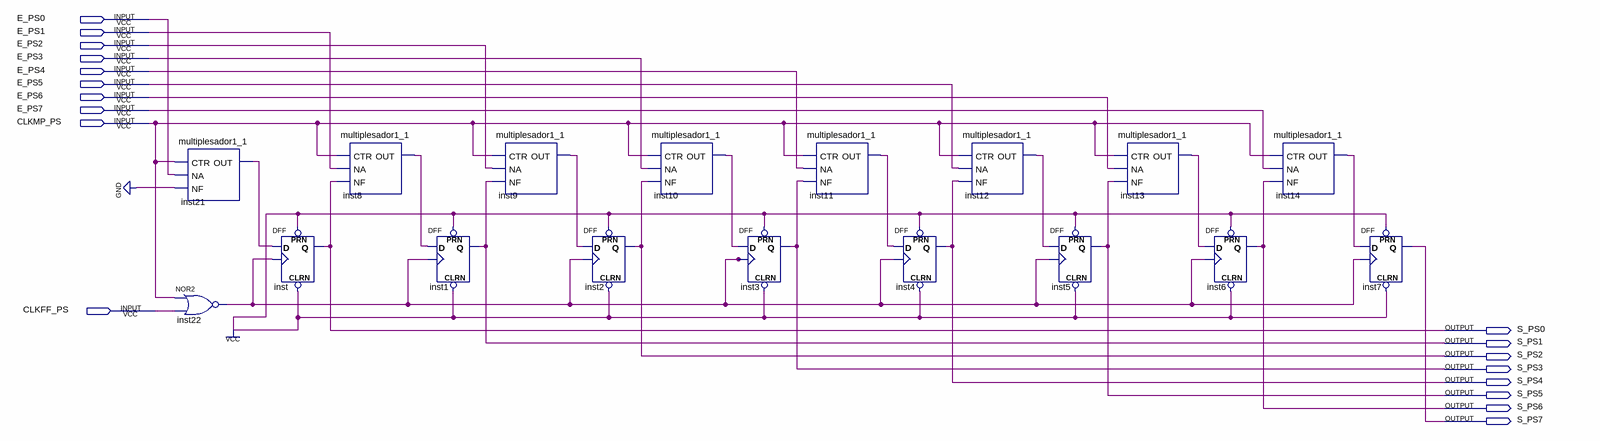
[diagram p0: schematic sheet]
// Quartus schematic PISO.bdf as structural Verilog: 17 symbols, 18 pins
module PISO (
  input  E_PS0,
  input  E_PS1,
  input  E_PS2,
  input  E_PS3,
  input  E_PS4,
  input  E_PS5,
  input  E_PS6,
  input  E_PS7,
  input  CLKMP_PS,
  input  CLKFF_PS,
  output S_PS0,
  output S_PS1,
  output S_PS2,
  output S_PS3,
  output S_PS4,
  output S_PS5,
  output S_PS6,
  output S_PS7
);

  wire inst8_out, inst9_out, inst10_out, inst11_out, inst12_out, inst13_out, inst14_out, inst21_out,
       inst22_out;

  multiplesador1_1 inst21 (.CTR(CLKMP_PS), .NA(E_PS0), .NF(1'b0), .OUT(inst21_out));
  nor inst22 (inst22_out, CLKMP_PS, CLKFF_PS);
  DFF inst (.CLRN(1'b1), .CLK(inst22_out), .D(inst21_out), .PRN(1'b1), .Q(S_PS0));
  multiplesador1_1 inst8 (.CTR(CLKMP_PS), .NA(E_PS1), .NF(S_PS0), .OUT(inst8_out));
  DFF inst1 (.CLRN(1'b1), .CLK(inst22_out), .D(inst8_out), .PRN(1'b1), .Q(S_PS1));
  multiplesador1_1 inst9 (.CTR(CLKMP_PS), .NA(E_PS2), .NF(S_PS1), .OUT(inst9_out));
  DFF inst2 (.CLRN(1'b1), .CLK(inst22_out), .D(inst9_out), .PRN(1'b1), .Q(S_PS2));
  multiplesador1_1 inst10 (.CTR(CLKMP_PS), .NA(E_PS3), .NF(S_PS2), .OUT(inst10_out));
  DFF inst3 (.CLRN(1'b1), .CLK(inst22_out), .D(inst10_out), .PRN(1'b1), .Q(S_PS3));
  multiplesador1_1 inst11 (.CTR(CLKMP_PS), .NA(E_PS4), .NF(S_PS3), .OUT(inst11_out));
  DFF inst4 (.CLRN(1'b1), .CLK(inst22_out), .D(inst11_out), .PRN(1'b1), .Q(S_PS4));
  multiplesador1_1 inst12 (.CTR(CLKMP_PS), .NA(E_PS5), .NF(S_PS4), .OUT(inst12_out));
  DFF inst5 (.CLRN(1'b1), .CLK(inst22_out), .D(inst12_out), .PRN(1'b1), .Q(S_PS5));
  multiplesador1_1 inst13 (.CTR(CLKMP_PS), .NA(E_PS6), .NF(S_PS5), .OUT(inst13_out));
  DFF inst6 (.CLRN(1'b1), .CLK(inst22_out), .D(inst13_out), .PRN(1'b1), .Q(S_PS6));
  multiplesador1_1 inst14 (.CTR(CLKMP_PS), .NA(E_PS7), .NF(S_PS6), .OUT(inst14_out));
  DFF inst7 (.CLRN(1'b1), .CLK(inst22_out), .D(inst14_out), .PRN(1'b1), .Q(S_PS7));
endmodule
